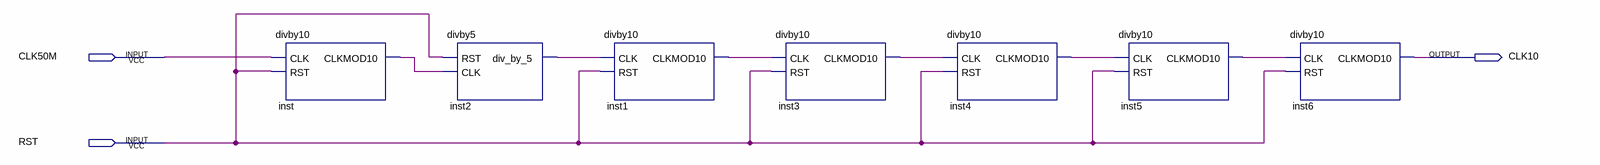
[diagram p0: schematic sheet]
// Quartus schematic 10HzClock.bdf as structural Verilog: 7 symbols, 3 pins
module \10HzClock  (
  input  CLK50M,
  input  RST,
  output CLK10
);

  wire inst1_clkmod10, inst2_div_by_5, inst3_clkmod10, inst4_clkmod10, inst5_clkmod10, inst_clkmod10;

  divby10 inst (.CLK(CLK50M), .RST(RST), .CLKMOD10(inst_clkmod10));
  divby5 inst2 (.RST(RST), .CLK(inst_clkmod10), .div_by_5(inst2_div_by_5));
  divby10 inst1 (.CLK(inst2_div_by_5), .RST(RST), .CLKMOD10(inst1_clkmod10));
  divby10 inst3 (.CLK(inst1_clkmod10), .RST(RST), .CLKMOD10(inst3_clkmod10));
  divby10 inst4 (.CLK(inst3_clkmod10), .RST(RST), .CLKMOD10(inst4_clkmod10));
  divby10 inst5 (.CLK(inst4_clkmod10), .RST(RST), .CLKMOD10(inst5_clkmod10));
  divby10 inst6 (.CLK(inst5_clkmod10), .RST(RST), .CLKMOD10(CLK10));
endmodule
